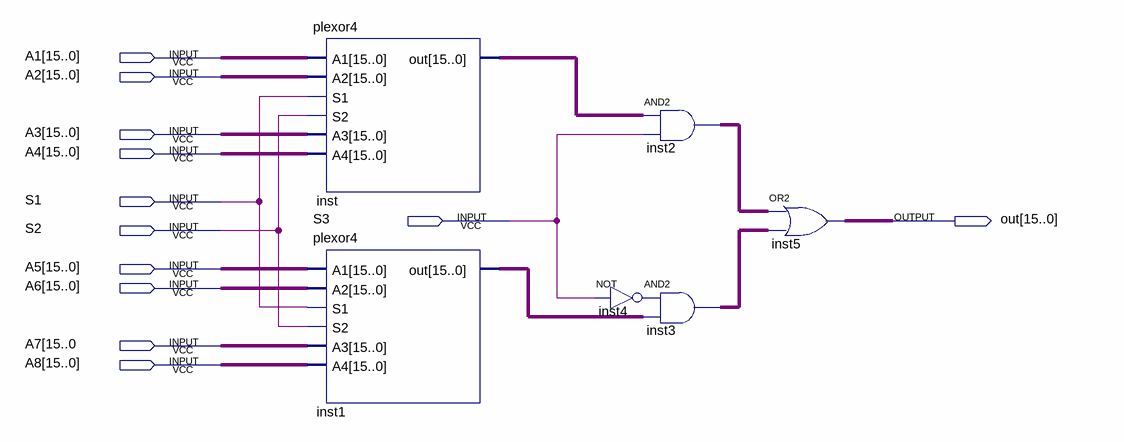
[diagram p0: schematic sheet]
// Quartus schematic plexor8.bdf as structural Verilog: 6 symbols, 12 pins
module plexor8 (
  input  [15:0] A1,
  input  [15:0] A2,
  input  [15:0] A3,
  input  [15:0] A4,
  input  S1,
  input  S3,
  input  S2,
  input  [15:0] A5,
  input  [15:0] A6,
  input  \A7[15..0 ,
  input  [15:0] A8,
  output [15:0] out
);

  wire [15:0] inst1_out, inst2_out, inst3_out, inst_out, undriven;

  plexor4 inst (.A1(A1), .A2(A2), .S1(S1), .S2(S2), .A3(A3), .A4(A4), .out(inst_out));
  plexor4 inst1 (.A1(A5), .A2(A6), .S1(S1), .S2(S2), .A3(undriven), .A4(A8), .out(inst1_out));
  assign inst2_out = inst_out & {16{S3}};  // AND2 inst2, 16 bits wide
  assign inst3_out = inst1_out;  // AND2 inst3, 16 bits wide AND2 open: IN1
  // NOT inst4 has open pins: IN=S3, OUT=open
  assign out = inst2_out | inst3_out;  // OR2 inst5, 16 bits wide
endmodule
